# EAGLE design strain-gauge-amplifier (EAGLE 7.1.0)
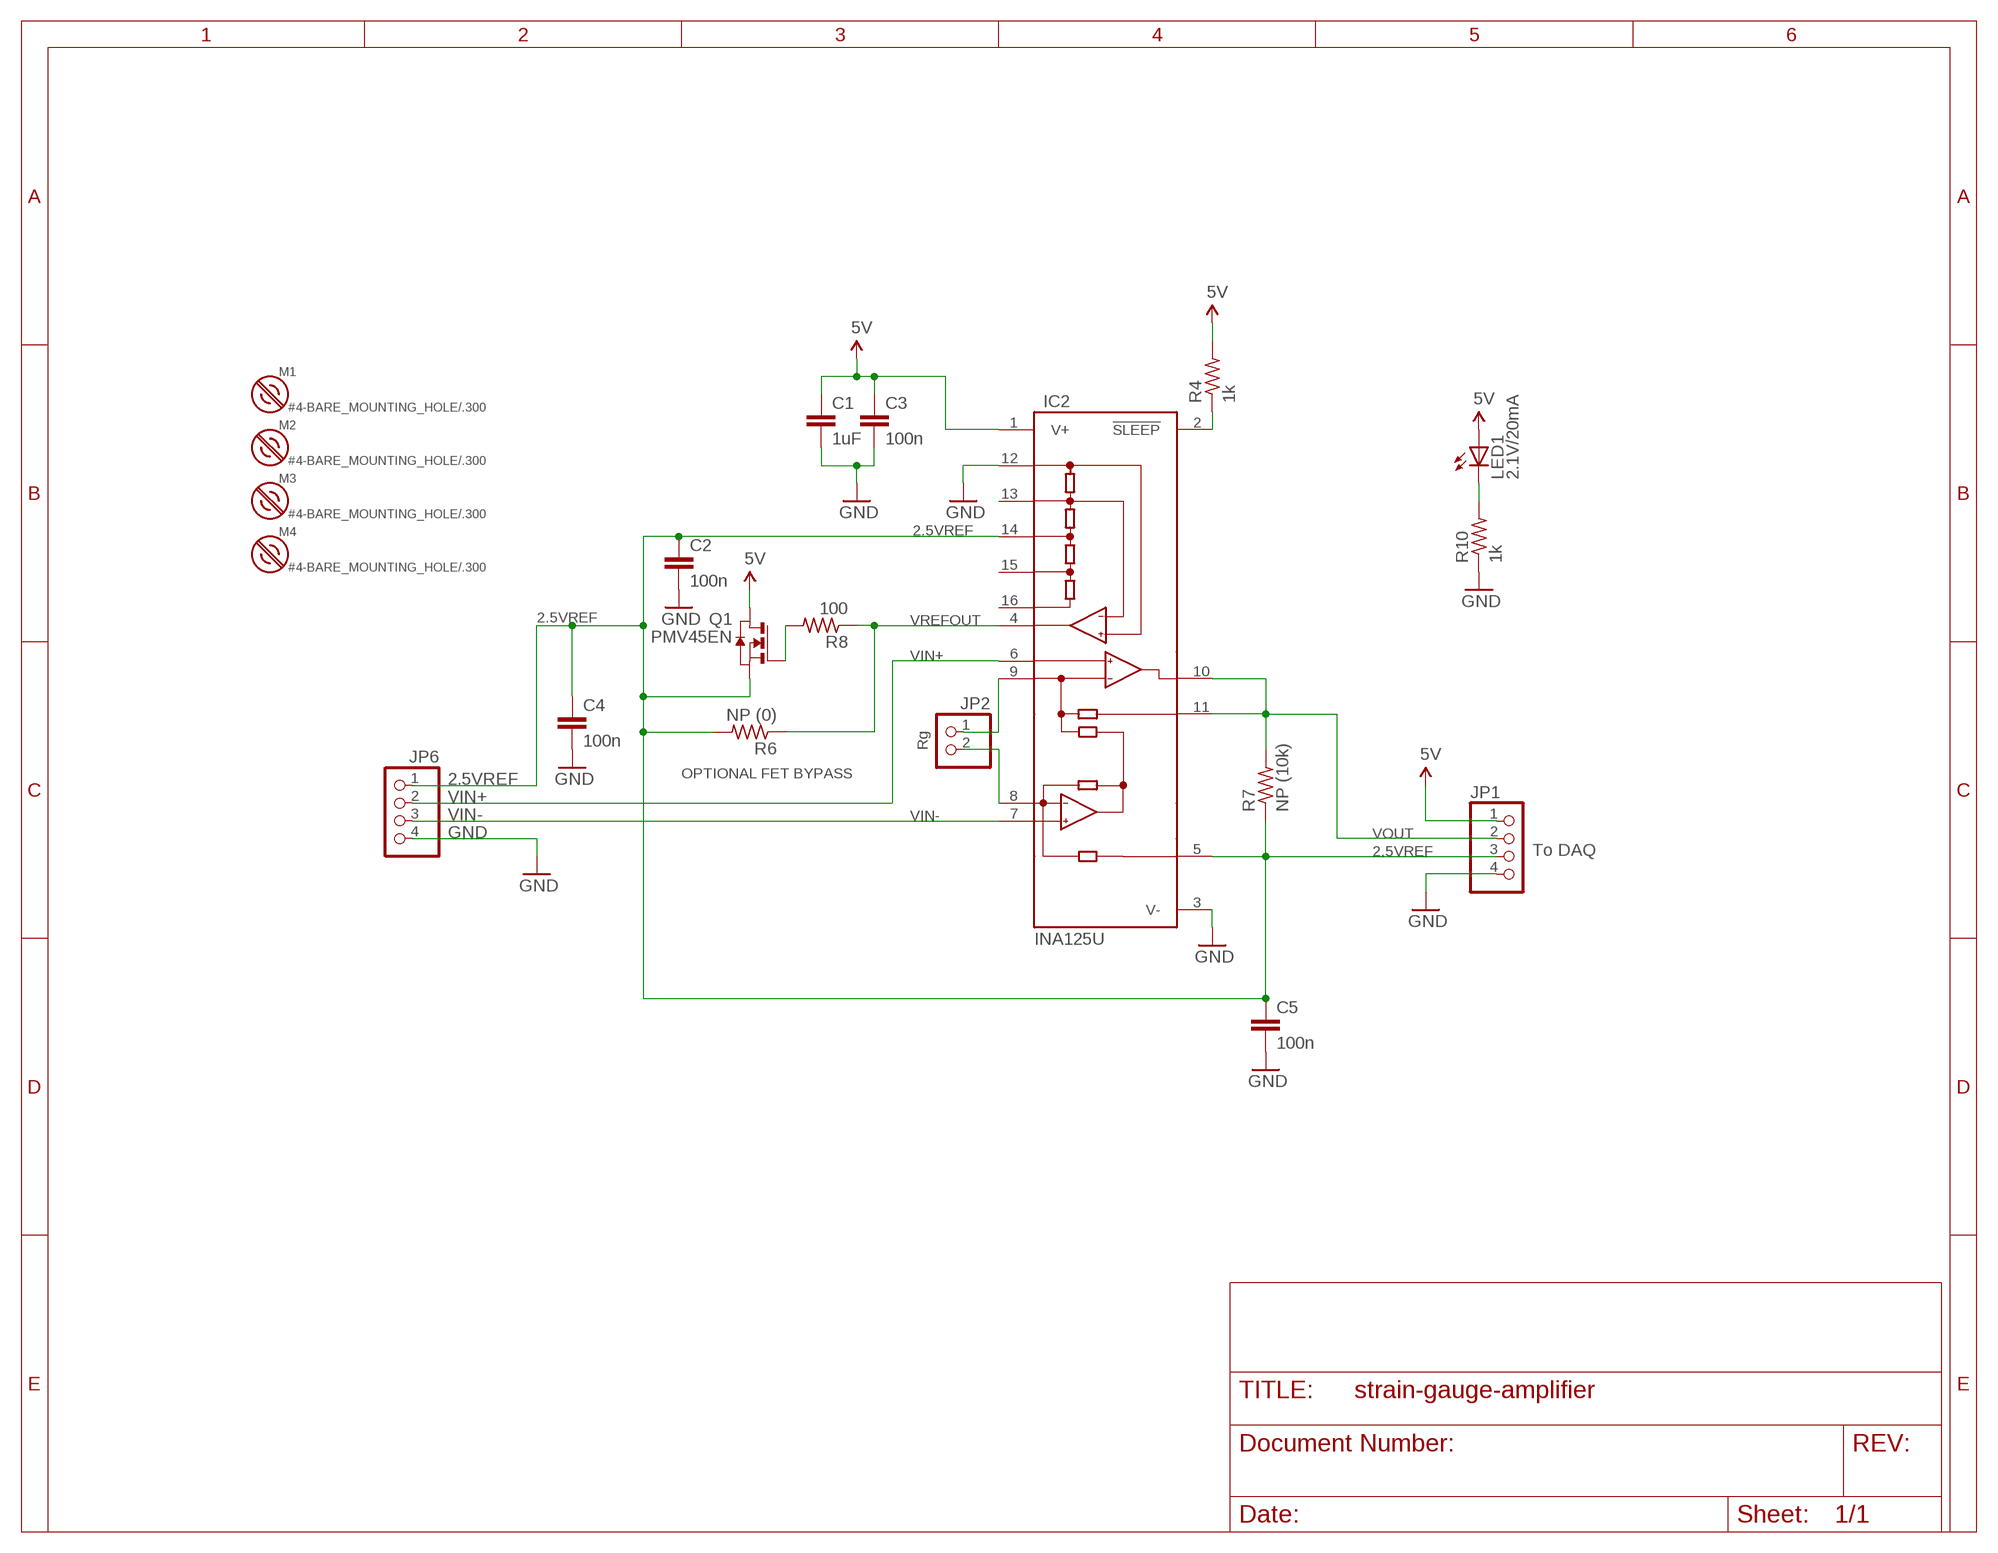
[diagram p0: schematic, sheet 1]

## Parts
C1  1uF  C-EU0805-C-NOSILK  [0805-C-NOSILK]
C2  100n  C-EU0805-C-NOSILK  [0805-C-NOSILK]
C3  100n  C-EU0805-C-NOSILK  [0805-C-NOSILK]
C4  100n  C-EU0805-C-NOSILK  [0805-C-NOSILK]
C5  100n  C-EU0805-C-NOSILK  [0805-C-NOSILK]
IC2  INA125U  [SO16-1]
JP1  PINHD-1X4  [1X04]
JP2  PINHD-1X2  [1X02]
JP6  PINHD-1X4  [1X04]
LED1  2.1V/20mA  LED0603  [LED-0603]
M1  #4-BARE_MOUNTING_HOLE/.300  [#4/.300-BARE+STD_NUT_OR_STAR_WASHER]
M2  #4-BARE_MOUNTING_HOLE/.300  [#4/.300-BARE+STD_NUT_OR_STAR_WASHER]
M3  #4-BARE_MOUNTING_HOLE/.300  [#4/.300-BARE+STD_NUT_OR_STAR_WASHER]
M4  #4-BARE_MOUNTING_HOLE/.300  [#4/.300-BARE+STD_NUT_OR_STAR_WASHER]
Q1  PMV45EN  [SOT23]
R4  1k  R-US_0805-C-NOSILK  [0805-C-NOSILK]
R6  NP (0)  R-US_0805-C-NOSILK  [0805-C-NOSILK]
R7  NP (10k)  R-US_0805-C-NOSILK  [0805-C-NOSILK]
R8  100  R-US_0805-C-NOSILK  [0805-C-NOSILK]
R10  1k  R-US_0805-C-NOSILK  [0805-C-NOSILK]

## Nets
2.5VREF: C2.1 C4.1 C5.1 IC2.5(REF) IC2.14(REF2.5) JP1.3 JP6.1 Q1.2(S) R6.2 R7.1
5V: C1.1 C3.1 IC2.1(V+) JP1.1 LED1.A Q1.3(D) R4.2
GND: C1.2 C2.2 C3.2 C4.2 C5.2 IC2.3(V-) IC2.12(REFCOM) JP1.4 JP6.4 R10.1
N$3: IC2.9(RG) JP2.1
N$5: IC2.8(RG) JP2.2
N$6: Q1.1(G) R8.2
N$8: IC2.2(!SLEEP) R4.1
N$11: LED1.C R10.2
VIN+: IC2.6(+IN) JP6.2
VIN-: IC2.7(-VIN) JP6.3
VOUT: IC2.10(OUT) IC2.11(SENSE) JP1.2 R7.2
VREFOUT: IC2.4(REFOUT) R6.1 R8.1
Unconnected: IC2.13(REFBG) IC2.15(REF5) IC2.16(REF10)

## Notes on the sheet
- Rg
- OPTIONAL FET BYPASS
- To DAQ

## Library data of the parts
C1-C5 = rcl_custom:C-EU: CAPACITOR, European symbol
IC2 = burr-brown:INA125: Instrumentation Amplifier with Precision Voltage Reference; MF: TEXAS INSTRUMENT CONNECTORS; MPN: INA125U; OC_FARNELL: 1304375; OC_NEWARK: 80K5901
JP1 JP6 = pinhead:PINHD-1X4: PIN HEADER
JP2 = pinhead:PINHD-1X2: PIN HEADER
LED1 = SparkFun-LED:LED: LEDs Standard schematic elements and footprints for 5mm, 3mm, 1206, and 0603 sized LEDs. 5mm - Spark Fun Electronics SKU : COM-00529 (and others)
M1-M4 = mount:#4-BARE_MOUNTING_HOLE: 1/8" drill hole for #4 screw mount
Q1 = Q_PMV45EN_N_ch_MOSFET:PMV45EN
R4 R6-R8 R10 = rcl_custom:R-US_: RESISTOR, American symbol

## Board
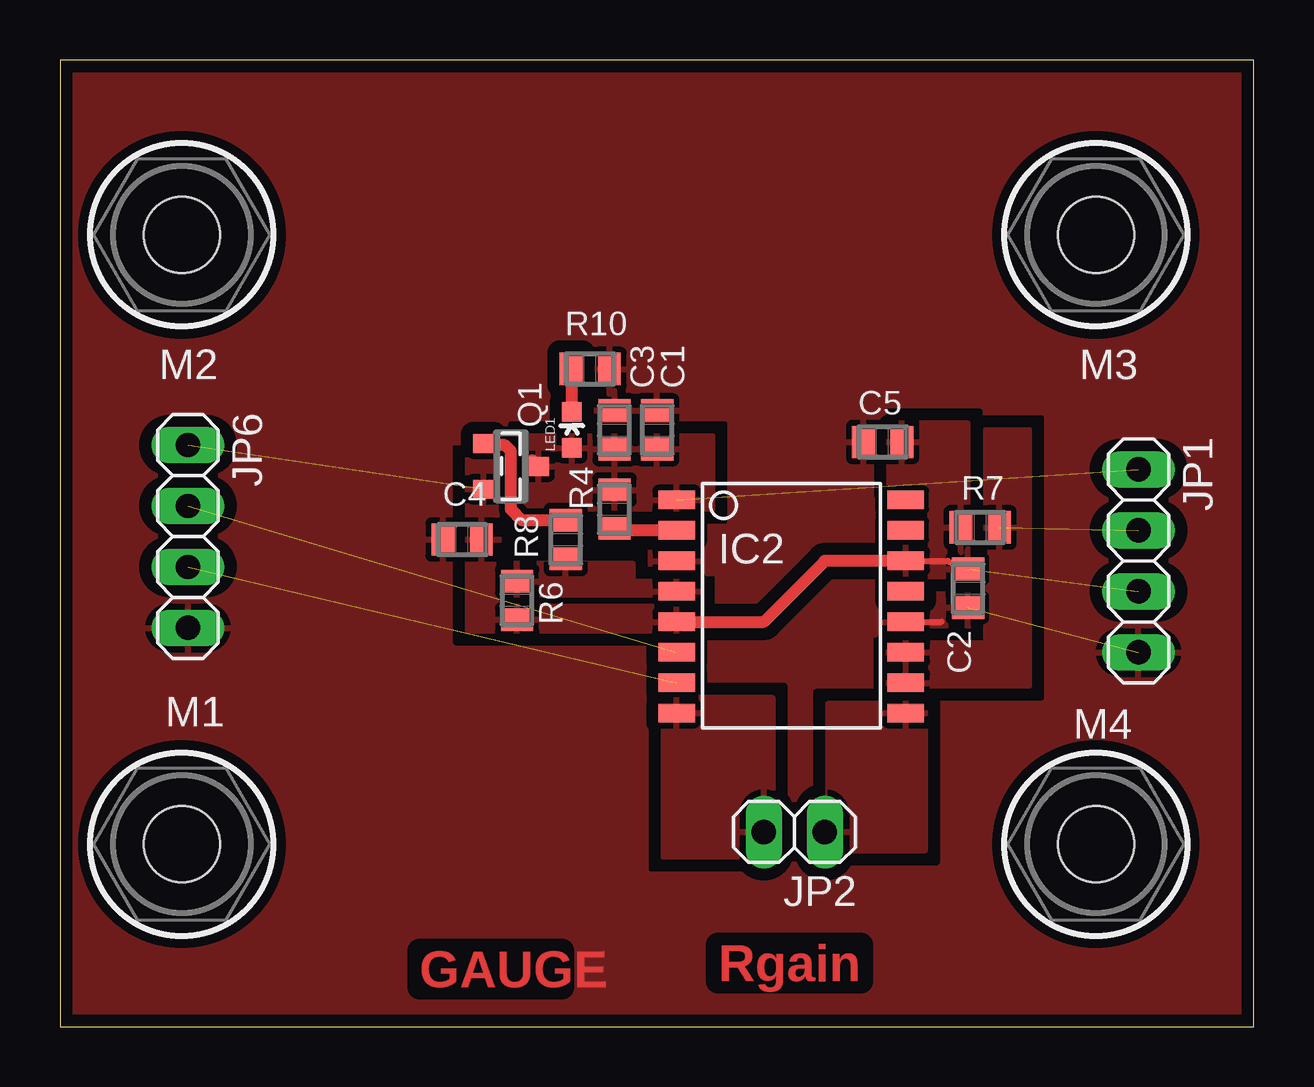
[diagram p1: board, top side]

Size 49.76 x 40.31 mm. Coordinates in mm from the lower left corner, seen from the top.
Outline: 0,0 49.76,0 49.76,40.31 0,40.31 0,0
Copper layers (1*16): Top 0.0178mm / dielectric 59mil / Bottom 0.0178mm
Design rules "epl-lpkf": minimum track width 8mil, minimum drill 0.35mm, track to track 8mil, track to pad 8mil, pad to pad 8mil, via to via 8mil, smd to smd 8mil, copper to edge 15mil, drill to drill 15mil, minimum pad ring 8mil, minimum via ring 8mil, stop-mask expansion 3mil, vias tented up to drill 0mil, thermal gap 10mil

### Footprints (pad centres in the part's own frame; a part is rotated, then mirrored left to right if it is on the bottom)
0805-C-NOSILK = smd 0.95 x 1.35: 1 -0.8,0; 2 0.8,0
SO16-1 = smd 0.762 x 1.524: 1 -4.445,-4.775; 2 -3.175,-4.775; 3 -1.905,-4.775; 4 -0.635,-4.775; 5 0.635,-4.775; 6 1.905,-4.775; 7 3.175,-4.775; 8 4.445,-4.775; 9 4.445,4.775; 10 3.175,4.775; 11 1.905,4.775; 12 0.635,4.775; 13 -0.635,4.775; 14 -1.905,4.775; 15 -3.175,4.775; 16 -4.445,4.775
1X04 = drill 1.016 long: 1 -3.81,0; 2 -1.27,0; 3 1.27,0; 4 3.81,0
1X02 = drill 1.016 long: 1 -1.27,0; 2 1.27,0
LED-0603 = smd 0.8 x 0.8: A 0,-0.75; C 0,0.75
#4/.300-BARE+STD_NUT_OR_STAR_WASHER = hole 3.175: 0,0
SOT23 = smd 0.787 x 0.889: 1 -0.953,-1.143; 2 0.953,-1.143; 3 0,1.143

### Placement (x,y rotation side)
C1  24.89,24.89 90 top
C2  37.85,18.29 270 top
C3  23.11,24.89 90 top
C4  16.76,20.32 180 top
C5  34.29,24.38 180 top
IC2  30.48,17.53 270 top
JP1  44.96,19.43 270 top
JP2  30.61,8.13 180 top
JP6  5.33,20.45 270 top
LED1  21.34,24.89 0 top
M1  5.08,7.62 0 top
M2  5.08,33.02 0 top
M3  43.18,33.02 0 top
M4  43.18,7.62 0 top
Q1  18.8,23.37 270 top
R4  23.11,21.59 90 top
R6  19.05,17.78 270 top
R7  38.35,20.83 0 top
R8  21.08,20.32 90 top
R10  22.1,27.43 180 top

### Tracks (layer width: path | path; a pad name or v marks a point on that pad's centre or on a via)
2.5VREF  (2 unrouted)
  Top 0.254: IC2.14 36.99,19.43 C2.1
  Top 0.508: IC2.14 31.88,19.43 29.34,16.89 IC2.5
  pour Top (isolate 0.254): 26.67,16.51 17.02,16.51 17.02,25.4 18.29,25.4 18.29,17.53 26.67,17.53
  pour Top (rank 2): 34.54,18.8 37.85,18.8 37.85,25.15 34.54,25.15
5V  (1 unrouted)
  Top 0.508: 19.68,23.62 Q1.3
  pour Top (isolate 0.254): 19.3,24.64 27.18,24.64 27.18,21.59 19.3,21.59
GND  (1 unrouted)
  Top 0.254: IC2.12 36.74,16.89
  pour Top (isolate 0.508, rank 5): 0,40.13 49.78,40.39 49.78,0 0,0
N$3
  pour Top: 36.07,13.46 32,13.46 32,7.37 36.07,7.37
N$5
  pour Top: 29.72,13.72 25.15,13.72 25.15,7.11 29.72,7.11
N$6
  Top 0.508: R8.2 19.27,21.12 18.8,21.59 18.8,24 18.54,24.26 17.65,24.26 | 17.65,24.26 17.53,24.38 | 17.65,24.26 Q1.1
N$8
  Top 0.508: IC2.2 23.2,20.7 R4.1
N$11
  Top 0.254: 21.34,27.39 R10.2
  Top 0.508: LED1.C 21.34,27.39
VIN+  (1 unrouted)
VIN-  (1 unrouted)
VOUT  (1 unrouted)
  pour Top: 40.39,24.89 40.39,14.22 34.54,14.22 34.54,16 38.61,16 38.61,24.89
VREFOUT
  pour Top (rank 2): 26.67,18.54 23.88,18.54 23.88,19.3 18.29,19.3 18.29,18.03 26.67,18.03

### Text on the board
Top: GAUGE | Rgain